# EAGLE schematic filter (EAGLE 8.6.0)
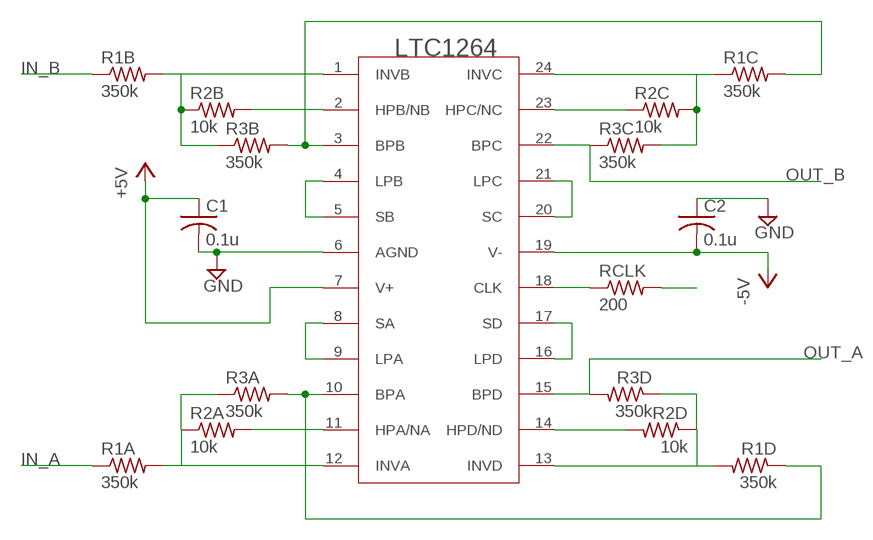
[diagram p0: schematic, sheet 1]

## Parts
C1  0.1u  C-USC0805  [C0805]
C2  0.1u  C-USC0805  [C0805]
R1A  350k  R-US_R0805  [R0805]
R1B  350k  R-US_R0805  [R0805]
R1C  350k  R-US_R0805  [R0805]
R1D  350k  R-US_R0805  [R0805]
R2A  10k  R-US_R0805  [R0805]
R2B  10k  R-US_R0805  [R0805]
R2C  10k  R-US_R0805  [R0805]
R2D  10k  R-US_R0805  [R0805]
R3A  350k  R-US_R0805  [R0805]
R3B  350k  R-US_R0805  [R0805]
R3C  350k  R-US_R0805  [R0805]
R3D  350k  R-US_R0805  [R0805]
RCLK  200  R-US_R0805  [R0805]
U$1  LTC1264SMD  [SO24W]

## Nets
+5V: C1.1 U$1.7(V+)
-5V: C2.2 U$1.19(V-)
GND: C1.2 C2.1 U$1.6(AGND)
IN_A: R1A.1
IN_B: R1B.1
N$2: R2D.2 U$1.14(HPD/ND)
N$3: R1D.2 R2D.1 R3D.1 U$1.13(INVD)
N$5: U$1.16(LPD) U$1.17(SD)
N$6: R2C.1 U$1.23(HPC/NC)
N$7: R1C.1 R2C.2 R3C.2 U$1.24(INVC)
N$9: R2B.2 U$1.2(HPB/NB)
N$10: R1B.2 R2B.1 R3B.1 U$1.1(INVB)
N$12: U$1.4(LPB) U$1.5(SB)
N$13: U$1.20(SC) U$1.21(LPC)
N$14: RCLK.1 U$1.18(CLK)
N$15: RCLK.2
N$16: R2A.2 U$1.11(HPA/NA)
N$18: U$1.8(SA) U$1.9(LPA)
N$32: R1A.2 R2A.1 R3A.1 U$1.12(INVA)
OUT_2ND_A: R1D.1 R3A.2 U$1.10(BPA)
OUT_2ND_ORDER_B: R1C.2 R3B.2 U$1.3(BPB)
OUT_A: R3D.2 U$1.15(BPD)
OUT_B: R3C.1 U$1.22(BPC)

## Library data of the parts
C1 C2 = rcl:C-US: CAPACITOR, American symbol; SPICEPREFIX: C
R1A R1B R1C R1D R2A R2B R2C R2D R3A R3B R3C R3D RCLK = rcl:R-US_: RESISTOR, American symbol; SPICEPREFIX: R
U$1 = ARVP:LTC1264